# EasyEDA Pro project can-mcu.eprj, schematic mod-digital-input-simple
Board Name: mod-input; Create Date: 2026-08-19; Page Name: 12v digital; Project Name: can-mcu; Schematic Name: mod-input; Update Date: 2026-08-19; Company: EasyEDA.com; Page Size: A4; Version: V1.0
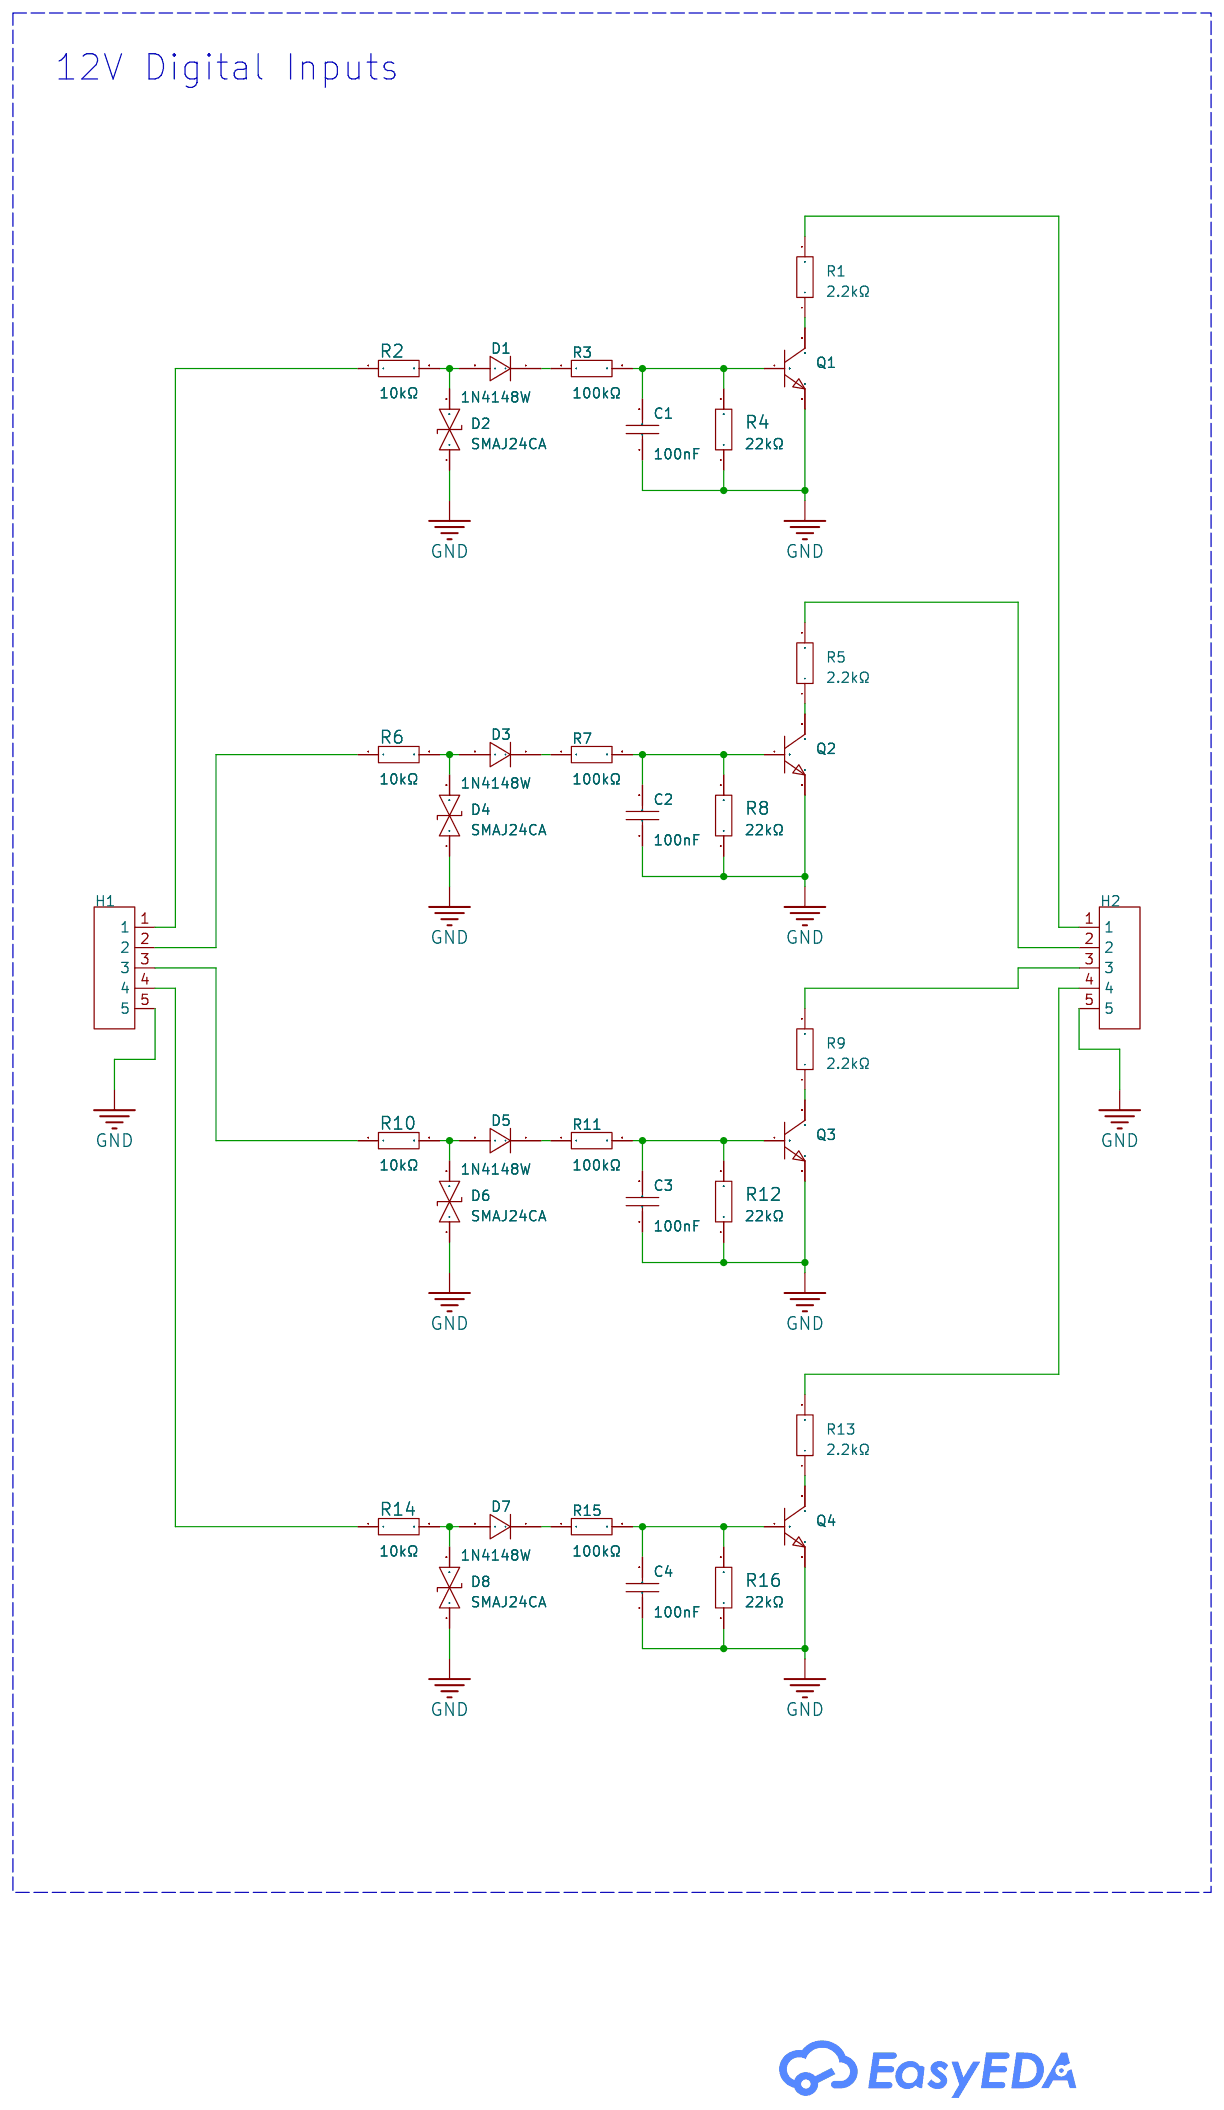
[diagram p6: schematic sheet]

## Parts
C1  100nF  [C0805]
C2  100nF  [C0805]
C3  100nF  [C0805]
C4  100nF  [C0805]
D1  1N4148W  [SOD-123F_L2.7-W1.6-LS3.8-RD]
D2  SMAJ24CA  [SMA_L4.4-W2.6-LS5.0-BI]
D3  1N4148W  [SOD-123F_L2.7-W1.6-LS3.8-RD]
D4  SMAJ24CA  [SMA_L4.4-W2.6-LS5.0-BI]
D5  1N4148W  [SOD-123F_L2.7-W1.6-LS3.8-RD]
D6  SMAJ24CA  [SMA_L4.4-W2.6-LS5.0-BI]
D7  1N4148W  [SOD-123F_L2.7-W1.6-LS3.8-RD]
D8  SMAJ24CA  [SMA_L4.4-W2.6-LS5.0-BI]
H1  PZ254V-11-05P  [HDR-TH_5P-P2.54-V-M]
H2  PZ254V-11-05P  [HDR-TH_5P-P2.54-V-M]
Q1  MMBT3904(RANGE:100-300)  [SOT-23-3_L2.9-W1.3-P1.90-LS2.4-BR]
Q2  MMBT3904(RANGE:100-300)  [SOT-23-3_L2.9-W1.3-P1.90-LS2.4-BR]
Q3  MMBT3904(RANGE:100-300)  [SOT-23-3_L2.9-W1.3-P1.90-LS2.4-BR]
Q4  MMBT3904(RANGE:100-300)  [SOT-23-3_L2.9-W1.3-P1.90-LS2.4-BR]
R1  2.2kΩ  [R0603]
R2  10kΩ  [R1206]
R3  100kΩ  [R0603]
R4  22kΩ  [R0603]
R5  2.2kΩ  [R0603]
R6  10kΩ  [R1206]
R7  100kΩ  [R0603]
R8  22kΩ  [R0603]
R9  2.2kΩ  [R0603]
R10  10kΩ  [R1206]
R11  100kΩ  [R0603]
R12  22kΩ  [R0603]
R13  2.2kΩ  [R0603]
R14  10kΩ  [R1206]
R15  100kΩ  [R0603]
R16  22kΩ  [R0603]

## Library data of the parts
C1-C4 = CL21B104KCFNNNE: LCSC Part Name: 100nF ±10% 100V; Supplier Part: C28233; Manufacturer: SAMSUNG(三星); Supplier Footprint: 0805; Datasheet: https://item.szlcsc.com/datasheet/CL21B104KCFNNNE/28983.html; Supplier: LCSC; Tolerance: ±10%; Voltage Rating: 100V; Temperature Coefficient: X7R
D1 D3 D5 D7 = 1N4148W_C81598: LCSC Part Name: 75V 150mA; Supplier Part: C81598; Manufacturer: ST(先科); Supplier Footprint: SOD-123; JLCPCB Part Class: Basic Part; Datasheet: https://item.szlcsc.com/datasheet/1N4148W/82750.html; Supplier: LCSC; Diode Configuration: Standalone; Pd - Power Dissipation: 400mW; Current - Rectified: 150mA; Voltage - DC Reverse(Vr): 75V; Voltage - Forward(Vf@If): 1V@50mA; Non-Repetitive Peak Forward Surge Current: 1A; Reverse Leakage Current (Ir): 1uA@75V; Reverse Recovery Time (trr): 4ns
D2 D4 D6 D8 = SMAJ24CA_C113963: LCSC Part Name: 双向TVS 24V截止 峰值脉冲电流：10.3A; Supplier Part: C113963; Manufacturer: MDD(辰达半导体); Supplier Footprint: DO-214AC(SMA); Datasheet: https://item.szlcsc.com/datasheet/SMAJ24CA/115202.html; Supplier: LCSC; Polarity: Bidirectional; Reverse Stand-Off Voltage (Vrwm): 24V; Clamping Voltage: 38.9V; Peak Pulse Current (Ipp): 10.3A; Peak Pulse Power Dissipation (Ppp): 400W@10/1000us; Voltage - Breakdown: 29.5V; Reverse Leakage Current (Ir): 1uA; Number of Channels: 1; Operating Temperature: -65℃~+150℃; level of protection: IEC 61000-4-2; Type: TVS
H1 H2 = PZ254V-11-05P: LCSC Part Name: 1x5P 间距:2.54mm 方针 直插; Supplier Part: C492404; Manufacturer: XFCN(兴飞); Supplier Footprint: 插件,P=2.54mm; Datasheet: https://item.szlcsc.com/datasheet/PZ254V-11-05P/502960.html; Supplier: LCSC; Pin Structure: 1x5P; Pitch: 2.54mm; Circluar Pins/Square Pins: Pin Header; Mounting Type: Through Hole; Number of Rows: 1; Number of Pins: 5P; Current Rating: 3A; Voltage Rating (Max): 250V; Length of Mating Pin: 6mm; Insulation Height: 2.5mm; Length of End Connection Pin: 3mm; Contact Material: Brass; Operating Temperature: -40℃~+105℃; Color: Black
Q1-Q4 = MMBT3904(RANGE:100-300): LCSC Part Name: hfe=100~300 NPN 电流:200mA 电压:40V; Supplier Part: C20526; Manufacturer: CJ(江苏长电/长晶); Supplier Footprint: SOT-23; JLCPCB Part Class: Basic Part; Datasheet: https://item.szlcsc.com/datasheet/MMBT3904(RANGE%253A100-300)/21237.html; Supplier: LCSC; type: NPN; Current - Collector(Ic): 200mA; Collector - Emitter Voltage VCEO: 40V; Pd - Power Dissipation: 200mW; DC Current Gain: 100@10mA,1V; Transition frequency(fT): 300MHz; Current - Collector Cutoff: 100nA; Vce Saturation(VCE(sat)): 300mV@50mA,5mA; Operating Temperature: -55℃~+150℃; Emitter-Base Voltage(Vebo): 6V; Number: 1 NPN
R1 R5 R9 R13 = 0603WAF2201T5E_C4190: Type:Thick Film Resistors Resistance:2.2kΩ Tolerance:±1% Tolerance:±1% Power(Watts): Overload Voltage (Max): Temperature Coefficient:±100ppm/℃ Temperature Coefficient:±100ppm/℃ Operating Temperature Range:-55℃~+155℃ Operating Temperature Range:-55℃~+155℃; LCSC Part Name: 2.2kΩ ±1% 100mW 厚膜电阻; Supplier Part: C4190; Manufacturer: UNI-ROYAL(厚声); Manufacturer Part: 0603WAF2201T5E; Supplier Footprint: 0603; JLCPCB Part Class: Basic Part; Datasheet: https://atta.szlcsc.com/upload/public/pdf/source/20200306/C422600_1E6D84923E4A46A82E41ADD87F860B5C.pdf; Supplier: LCSC; Type: Thick Film Resistors; Tolerance: ±1%; Temperature Coefficient: ±100ppm/℃; Operating Temperature Range: -55℃~+155℃
R2 R6 R10 R14 = 1206W4F1002T5E: LCSC Part Name: 10kΩ ±1% 250mW 厚膜电阻; Supplier Part: C17902; Manufacturer: UNI-ROYAL(厚声); Supplier Footprint: 1206; JLCPCB Part Class: Basic Part; Datasheet: https://item.szlcsc.com/datasheet/1206W4F1002T5E/18590.html; Supplier: LCSC; Type: Thick Film Resistor; Tolerance: ±1%; Power(Watts): 250mW; Voltage-Supply(Max): 200V; Temperature Coefficient: ±100ppm/℃; Operating Temperature: -55℃~+155℃
R3 R7 R11 R15 = 0603WAF1003T5E: Type:Thick Film Resistor Resistance:100kΩ Tolerance:±1% Tolerance:±1% Power(Watts):100mW Voltage-Supply(Max):75V Temperature Coefficient:±100ppm/℃ Temperature Coefficient:±100ppm/℃ Operating Temperature:-55℃~+155℃ Operating Temperature:-55℃~+155℃; LCSC Part Name: 100kΩ ±1% 100mW 厚膜电阻; Supplier Part: C25803; Manufacturer: UNI-ROYAL(厚声); Supplier Footprint: 0603; JLCPCB Part Class: Basic Part; Datasheet: https://item.szlcsc.com/datasheet/0603WAF1003T5E/26546.html; Supplier: LCSC; Type: Thick Film Resistor; Tolerance: ±1%; Power(Watts): 100mW; Voltage-Supply(Max): 75V; Temperature Coefficient: ±100ppm/℃; Operating Temperature: -55℃~+155℃
R4 R8 R12 R16 = 0603WAF2202T5E: LCSC Part Name: 22kΩ ±1% 100mW 厚膜电阻; Supplier Part: C31850; Manufacturer: UNI-ROYAL(厚声); Supplier Footprint: 0603; JLCPCB Part Class: Basic Part; Datasheet: https://item.szlcsc.com/datasheet/0603WAF2202T5E/32812.html; Supplier: LCSC; Type: Thick Film Resistor; Tolerance: ±1%; Power(Watts): 100mW; Voltage-Supply(Max): 75V; Temperature Coefficient: ±100ppm/℃; Operating Temperature: -55℃~+155℃

## Nets
GND: C1.1 C2.1 C3.1 C4.1 D2.1 D4.1 D6.1 D8.1 H1.5 H2.5 Q1.2(E) Q2.2(E) Q3.2(E) Q4.2(E) R4.1 R8.1 R12.1 R16.1
$1N1497: D1.1(K) R3.1
$1N1499: C1.2 Q1.1(B) R3.2 R4.2
$1N1500: Q1.3(C) R1.1
$1N1501: H2.1 R1.2
$1N1503: H1.1 R2.1
$1N1504: D1.2(A) D2.2 R2.2
$1N1505: D3.1(K) R7.1
$1N1507: C2.2 Q2.1(B) R7.2 R8.2
$1N1508: Q2.3(C) R5.1
$1N1509: H2.2 R5.2
$1N1511: H1.2 R6.1
$1N1512: D3.2(A) D4.2 R6.2
$1N1513: D5.1(K) R11.1
$1N1515: C3.2 Q3.1(B) R11.2 R12.2
$1N1516: Q3.3(C) R9.1
$1N1517: H2.3 R9.2
$1N1519: H1.3 R10.1
$1N1520: D5.2(A) D6.2 R10.2
$1N1521: D7.1(K) R15.1
$1N1523: C4.2 Q4.1(B) R15.2 R16.2
$1N1524: Q4.3(C) R13.1
$1N1525: H2.4 R13.2
$1N1527: H1.4 R14.1
$1N1528: D7.2(A) D8.2 R14.2

## Notes on the sheet
- 12V Digital Inputs
